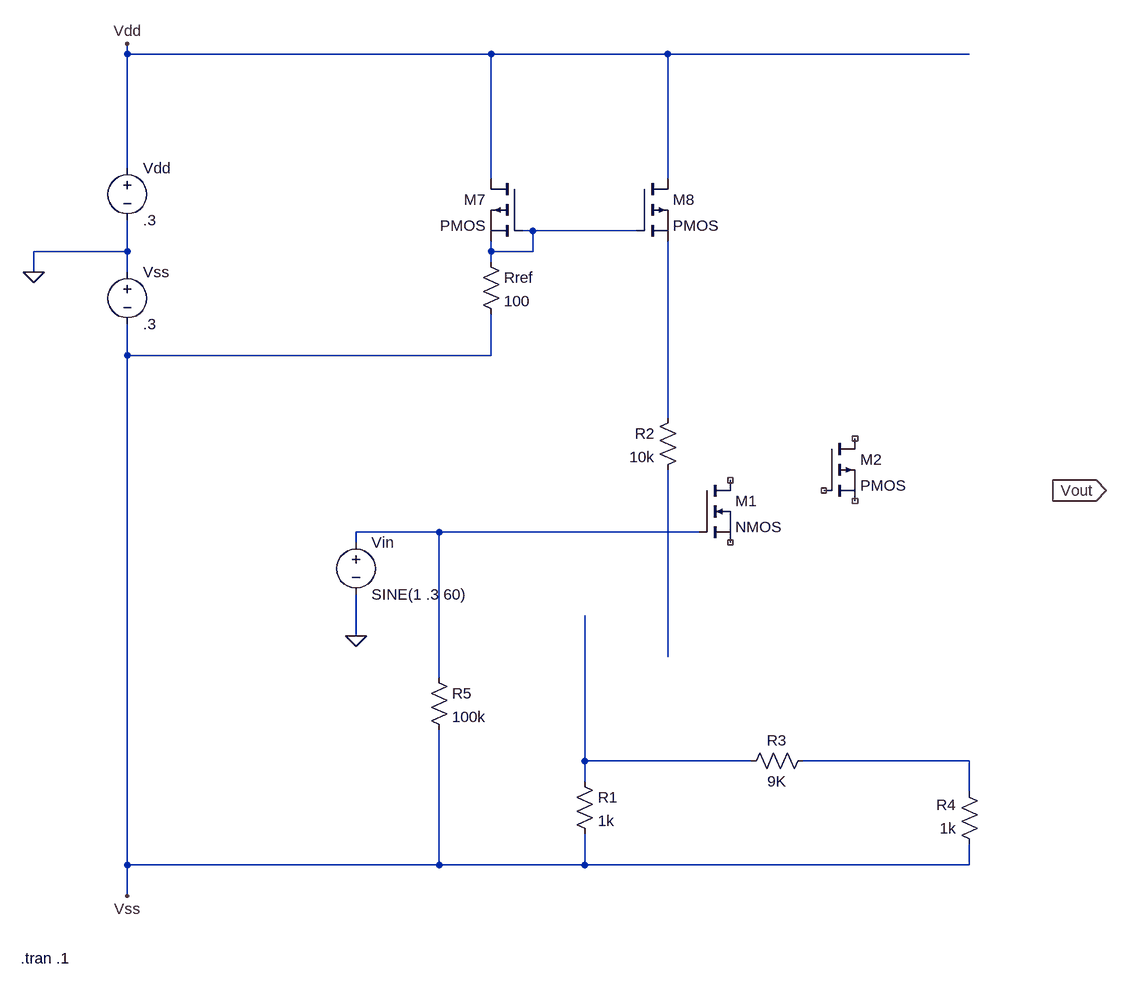
[diagram p0: schematic CD4007_FULL.asc]
CD4007_FULL.asc, the LTspice schematic file:
Version 4
SHEET 1 880 768
WIRE -800 -640 -800 -656
WIRE -240 -640 -800 -640
WIRE 32 -640 -240 -640
WIRE 496 -640 32 -640
WIRE -800 -464 -800 -640
WIRE -240 -448 -240 -640
WIRE 32 -448 32 -640
WIRE -176 -368 -192 -368
WIRE -16 -368 -176 -368
WIRE -800 -336 -800 -384
WIRE -800 -336 -944 -336
WIRE -240 -336 -240 -352
WIRE -176 -336 -176 -368
WIRE -176 -336 -240 -336
WIRE -240 -320 -240 -336
WIRE -944 -304 -944 -336
WIRE -800 -304 -800 -336
WIRE -800 -176 -800 -224
WIRE -240 -176 -240 -240
WIRE -240 -176 -800 -176
WIRE 32 -80 32 -352
WIRE -320 96 -448 96
WIRE 80 96 -320 96
WIRE -448 112 -448 96
WIRE -448 256 -448 192
WIRE 32 288 32 0
WIRE -320 320 -320 96
WIRE -96 448 -96 224
WIRE 160 448 -96 448
WIRE 496 448 240 448
WIRE -96 480 -96 448
WIRE 496 496 496 448
WIRE -800 608 -800 -176
WIRE -320 608 -320 400
WIRE -320 608 -800 608
WIRE -96 608 -96 560
WIRE -96 608 -320 608
WIRE 496 608 496 576
WIRE 496 608 -96 608
WIRE -800 656 -800 608
FLAG -448 256 0
FLAG -944 -304 0
FLAG -800 -656 Vdd
FLAG -800 656 Vss
FLAG 624 32 Vout
IOPIN 624 32 Out
SYMBOL res -112 464 R0
SYMATTR InstName R1
SYMATTR Value 1k
SYMBOL res 48 -96 M0
SYMATTR InstName R2
SYMATTR Value 10k
SYMBOL voltage -448 96 R0
WINDOW 123 0 0 Left 2
WINDOW 39 0 0 Left 2
SYMATTR InstName Vin
SYMATTR Value SINE(1 .3 60)
SYMBOL pmos -192 -448 M0
SYMATTR InstName M7
SYMBOL pmos -16 -448 R0
SYMATTR InstName M8
SYMBOL res -256 -336 R0
SYMATTR InstName Rref
SYMATTR Value 100
SYMBOL voltage -800 -480 R0
WINDOW 123 0 0 Left 2
WINDOW 39 0 0 Left 2
SYMATTR InstName Vdd
SYMATTR Value .3
SYMBOL voltage -800 -320 R0
WINDOW 123 0 0 Left 2
WINDOW 39 0 0 Left 2
SYMATTR InstName Vss
SYMATTR Value .3
SYMBOL res 256 432 R90
WINDOW 0 0 56 VBottom 2
WINDOW 3 32 56 VTop 2
SYMATTR InstName R3
SYMATTR Value 9K
SYMBOL res 512 592 R180
WINDOW 0 36 76 Left 2
WINDOW 3 36 40 Left 2
SYMATTR InstName R4
SYMATTR Value 1k
SYMBOL res -336 304 R0
SYMATTR InstName R5
SYMATTR Value 100k
SYMBOL nmos 80 16 R0
SYMATTR InstName M1
SYMBOL pmos 272 -48 R0
SYMATTR InstName M2
TEXT -964 752 Left 2 !.tran .1

The netlist it stands for:
* CD4007_FULL.asc
R1 N005 Vss 1k
R2 N002 N004 10k
Vin N003 0 SINE(1 .3 60)
M7 Vdd N001 N001 N001 PMOS
M8 Vdd N001 N002 N002 PMOS
Rref N001 Vss 100
Vdd Vdd 0 .3
Vss 0 Vss .3
R3 N006 N005 9K
R4 Vss N006 1k
R5 N003 Vss 100k
M1 NC_01 N003 NC_02 NC_02 NMOS
M2 NC_03 NC_04 NC_05 NC_05 PMOS
.model NMOS NMOS
.model PMOS PMOS
.lib standard.mos
.tran .1
.backanno
.end